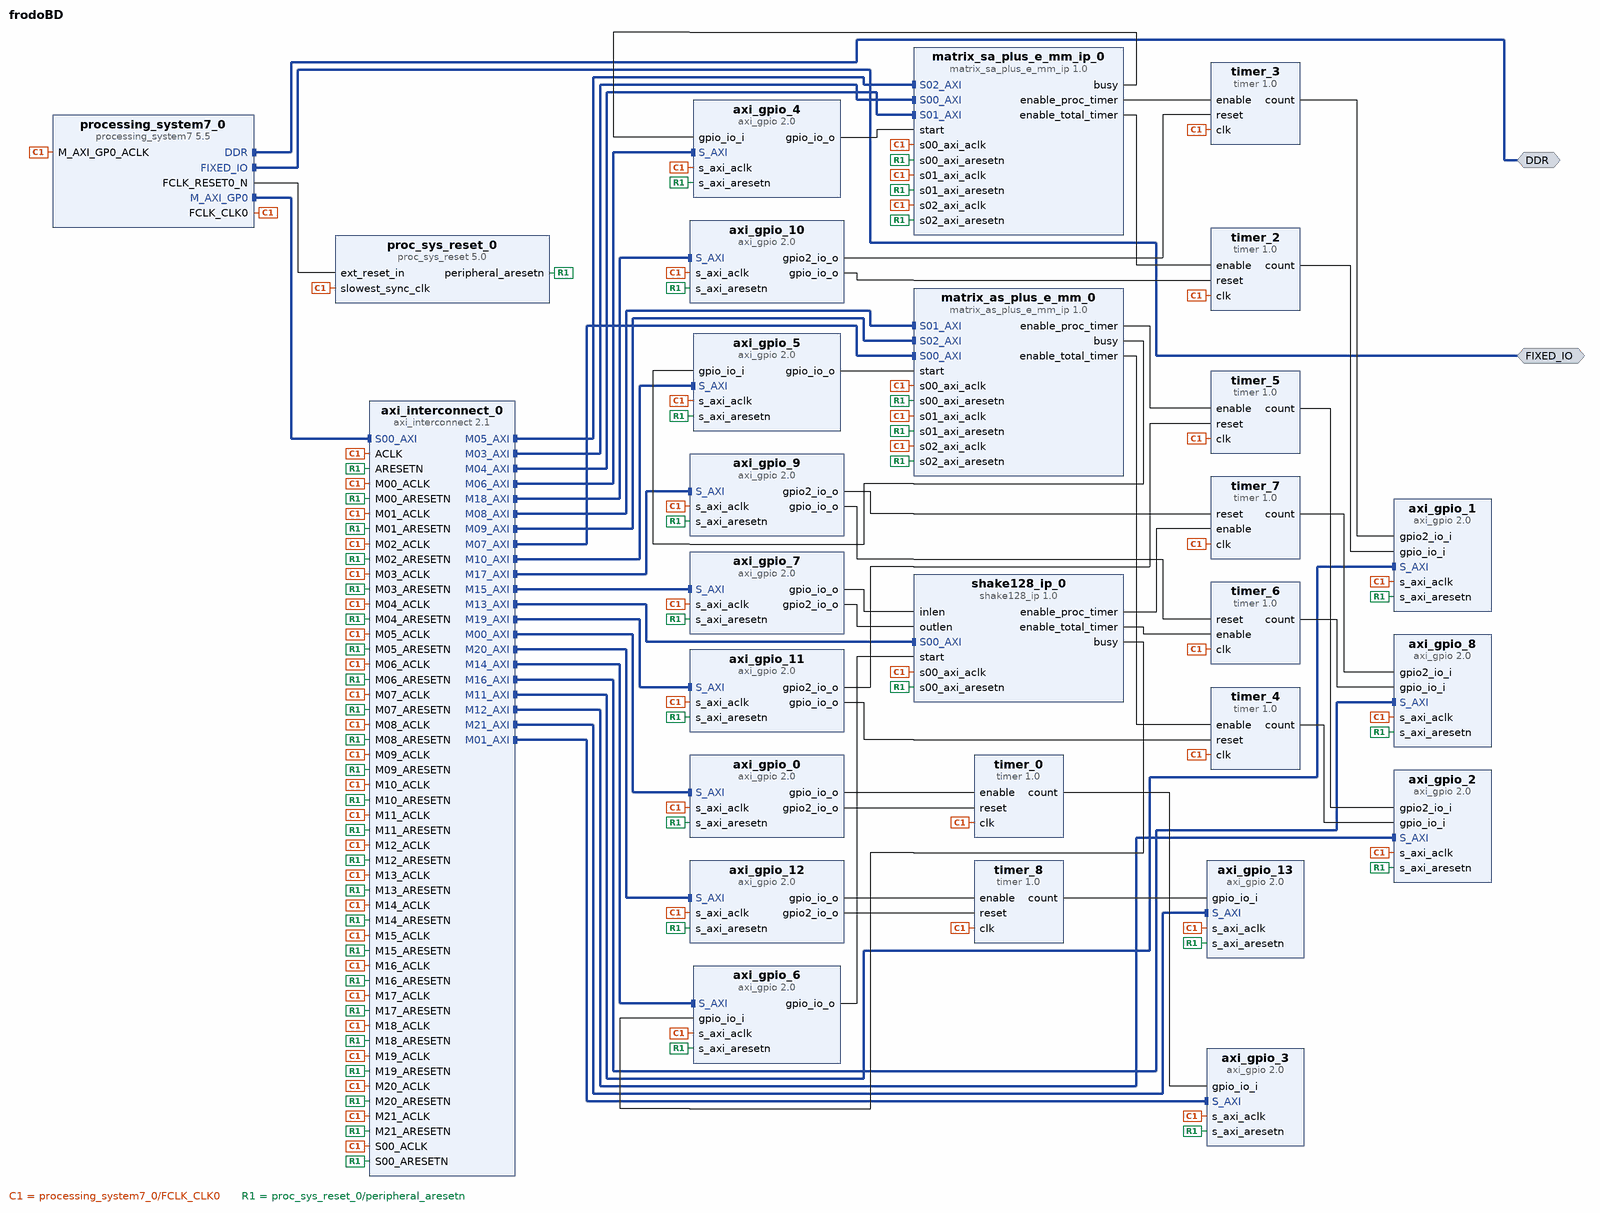
[diagram p0: block diagram of the top level]
# Vivado block design frodoBD, xc7z010clg400-1, Vivado 2019.1
create_bd_design frodoBD

create_bd_intf_port -mode Master -vlnv xilinx.com:interface:ddrx_rtl:1.0 DDR
create_bd_intf_port -mode Master -vlnv xilinx.com:display_processing_system7:fixedio_rtl:1.0 FIXED_IO

create_bd_cell -type ip -vlnv xilinx.com:ip:processing_system7:5.5 processing_system7_0
set_property -dict [list \
  CONFIG.PCW_APU_PERIPHERAL_FREQMHZ 667 \
  CONFIG.PCW_ENET0_ENET0_IO {MIO 16 .. 27} \
  CONFIG.PCW_ENET0_GRP_MDIO_ENABLE 1 \
  CONFIG.PCW_ENET0_GRP_MDIO_IO {MIO 52 .. 53} \
  CONFIG.PCW_ENET0_PERIPHERAL_ENABLE 1 \
  CONFIG.PCW_ENET0_RESET_ENABLE 0 \
  CONFIG.PCW_ENET_RESET_ENABLE 1 \
  CONFIG.PCW_ENET_RESET_SELECT {Share reset pin} \
  CONFIG.PCW_FPGA0_PERIPHERAL_FREQMHZ 100 \
  CONFIG.PCW_FPGA1_PERIPHERAL_FREQMHZ 100 \
  CONFIG.PCW_FPGA2_PERIPHERAL_FREQMHZ 33.333333 \
  CONFIG.PCW_GPIO_MIO_GPIO_ENABLE 1 \
  CONFIG.PCW_GPIO_MIO_GPIO_IO MIO \
  CONFIG.PCW_GPIO_PERIPHERAL_ENABLE 1 \
  CONFIG.PCW_I2C_RESET_ENABLE 0 \
  CONFIG.PCW_PRESET_BANK1_VOLTAGE {LVCMOS 1.8V} \
  CONFIG.PCW_QSPI_GRP_FBCLK_ENABLE 1 \
  CONFIG.PCW_QSPI_GRP_FBCLK_IO {MIO 8} \
  CONFIG.PCW_QSPI_GRP_SINGLE_SS_ENABLE 1 \
  CONFIG.PCW_QSPI_GRP_SINGLE_SS_IO {MIO 1 .. 6} \
  CONFIG.PCW_QSPI_PERIPHERAL_ENABLE 1 \
  CONFIG.PCW_QSPI_QSPI_IO {MIO 1 .. 6} \
  CONFIG.PCW_SD0_GRP_CD_ENABLE 1 \
  CONFIG.PCW_SD0_GRP_CD_IO {MIO 46} \
  CONFIG.PCW_SD0_GRP_WP_ENABLE 1 \
  CONFIG.PCW_SD0_GRP_WP_IO {MIO 50} \
  CONFIG.PCW_SD0_PERIPHERAL_ENABLE 1 \
  CONFIG.PCW_SD0_SD0_IO {MIO 40 .. 45} \
  CONFIG.PCW_SDIO_PERIPHERAL_FREQMHZ 25 \
  CONFIG.PCW_SINGLE_QSPI_DATA_MODE x4 \
  CONFIG.PCW_TTC0_PERIPHERAL_ENABLE 1 \
  CONFIG.PCW_TTC0_TTC0_IO EMIO \
  CONFIG.PCW_UART0_PERIPHERAL_ENABLE 1 \
  CONFIG.PCW_UART0_UART0_IO {MIO 14 .. 15} \
  CONFIG.PCW_UART1_PERIPHERAL_ENABLE 1 \
  CONFIG.PCW_UART1_UART1_IO {MIO 48 .. 49} \
  CONFIG.PCW_UART_PERIPHERAL_FREQMHZ 50 \
  CONFIG.PCW_UIPARAM_DDR_PARTNO {MT41K256M16 RE-125} \
  CONFIG.PCW_USB0_PERIPHERAL_ENABLE 1 \
  CONFIG.PCW_USB0_RESET_ENABLE 1 \
  CONFIG.PCW_USB0_RESET_IO {MIO 7} \
  CONFIG.PCW_USB0_USB0_IO {MIO 28 .. 39} \
  CONFIG.PCW_USB_RESET_ENABLE 1 \
  CONFIG.PCW_USB_RESET_SELECT {Share reset pin} \
] [get_bd_cells processing_system7_0]
# 278 more settings of processing_system7_0 are not shown: defaults, MIO pin electricals, DDR timing, and values the tool derives
create_bd_cell -type ip -vlnv xilinx.com:ip:proc_sys_reset:5.0 proc_sys_reset_0
create_bd_cell -type ip -vlnv xilinx.com:ip:axi_interconnect:2.1 axi_interconnect_0
set_property -dict {CONFIG.NUM_MI 22} [get_bd_cells axi_interconnect_0]
create_bd_cell -type ip -vlnv xilinx.com:ip:axi_gpio:2.0 axi_gpio_4
set_property -dict {CONFIG.C_GPIO_WIDTH 1} [get_bd_cells axi_gpio_4]
create_bd_cell -type ip -vlnv xilinx.com:ip:axi_gpio:2.0 axi_gpio_5
set_property -dict {CONFIG.C_GPIO_WIDTH 1} [get_bd_cells axi_gpio_5]
create_bd_cell -type ip -vlnv xilinx.com:user:timer:1.0 timer_2
create_bd_cell -type ip -vlnv xilinx.com:user:timer:1.0 timer_3
create_bd_cell -type ip -vlnv xilinx.com:ip:axi_gpio:2.0 axi_gpio_1
set_property -dict [list \
  CONFIG.C_ALL_INPUTS 1 \
  CONFIG.C_ALL_INPUTS_2 1 \
  CONFIG.C_GPIO_WIDTH 32 \
  CONFIG.C_IS_DUAL 1 \
] [get_bd_cells axi_gpio_1]
create_bd_cell -type ip -vlnv xilinx.com:ip:axi_gpio:2.0 axi_gpio_2
set_property -dict [list \
  CONFIG.C_ALL_INPUTS 1 \
  CONFIG.C_ALL_INPUTS_2 1 \
  CONFIG.C_GPIO_WIDTH 32 \
  CONFIG.C_IS_DUAL 1 \
] [get_bd_cells axi_gpio_2]
create_bd_cell -type ip -vlnv xilinx.com:user:timer:1.0 timer_4
create_bd_cell -type ip -vlnv xilinx.com:user:timer:1.0 timer_5
create_bd_cell -type ip -vlnv xilinx.com:ip:axi_gpio:2.0 axi_gpio_6
set_property -dict {CONFIG.C_GPIO_WIDTH 1} [get_bd_cells axi_gpio_6]
create_bd_cell -type ip -vlnv xilinx.com:ip:axi_gpio:2.0 axi_gpio_7
set_property -dict [list \
  CONFIG.C_ALL_INPUTS 0 \
  CONFIG.C_ALL_INPUTS_2 0 \
  CONFIG.C_ALL_OUTPUTS 1 \
  CONFIG.C_ALL_OUTPUTS_2 1 \
  CONFIG.C_GPIO2_WIDTH 15 \
  CONFIG.C_GPIO_WIDTH 15 \
  CONFIG.C_IS_DUAL 1 \
] [get_bd_cells axi_gpio_7]
create_bd_cell -type ip -vlnv xilinx.com:user:timer:1.0 timer_6
create_bd_cell -type ip -vlnv xilinx.com:user:timer:1.0 timer_7
create_bd_cell -type ip -vlnv xilinx.com:ip:axi_gpio:2.0 axi_gpio_8
set_property -dict {CONFIG.C_ALL_INPUTS 1 CONFIG.C_ALL_INPUTS_2 1 CONFIG.C_IS_DUAL 1} [get_bd_cells axi_gpio_8]
create_bd_cell -type ip -vlnv xilinx.com:user:shake128_ip:1.0 shake128_ip_0
create_bd_cell -type ip -vlnv xilinx.com:ip:axi_gpio:2.0 axi_gpio_9
set_property -dict [list \
  CONFIG.C_ALL_OUTPUTS 1 \
  CONFIG.C_ALL_OUTPUTS_2 1 \
  CONFIG.C_GPIO2_WIDTH 1 \
  CONFIG.C_GPIO_WIDTH 1 \
  CONFIG.C_IS_DUAL 1 \
] [get_bd_cells axi_gpio_9]
create_bd_cell -type ip -vlnv xilinx.com:ip:axi_gpio:2.0 axi_gpio_10
set_property -dict [list \
  CONFIG.C_ALL_INPUTS 0 \
  CONFIG.C_ALL_OUTPUTS 1 \
  CONFIG.C_ALL_OUTPUTS_2 1 \
  CONFIG.C_GPIO2_WIDTH 1 \
  CONFIG.C_GPIO_WIDTH 1 \
  CONFIG.C_IS_DUAL 1 \
] [get_bd_cells axi_gpio_10]
create_bd_cell -type ip -vlnv xilinx.com:ip:axi_gpio:2.0 axi_gpio_11
set_property -dict [list \
  CONFIG.C_ALL_OUTPUTS 1 \
  CONFIG.C_ALL_OUTPUTS_2 1 \
  CONFIG.C_GPIO2_WIDTH 1 \
  CONFIG.C_GPIO_WIDTH 1 \
  CONFIG.C_IS_DUAL 1 \
] [get_bd_cells axi_gpio_11]
create_bd_cell -type ip -vlnv xilinx.com:user:timer:1.0 timer_8
create_bd_cell -type ip -vlnv xilinx.com:ip:axi_gpio:2.0 axi_gpio_12
set_property -dict [list \
  CONFIG.C_ALL_OUTPUTS 1 \
  CONFIG.C_ALL_OUTPUTS_2 1 \
  CONFIG.C_GPIO2_WIDTH 1 \
  CONFIG.C_GPIO_WIDTH 1 \
  CONFIG.C_IS_DUAL 1 \
] [get_bd_cells axi_gpio_12]
create_bd_cell -type ip -vlnv xilinx.com:ip:axi_gpio:2.0 axi_gpio_13
set_property -dict {CONFIG.C_ALL_INPUTS 1} [get_bd_cells axi_gpio_13]
create_bd_cell -type ip -vlnv xilinx.com:user:matrix_as_plus_e_mm_ip:1.0 matrix_as_plus_e_mm_0
create_bd_cell -type ip -vlnv xilinx.com:user:matrix_sa_plus_e_mm_ip:1.0 matrix_sa_plus_e_mm_ip_0
create_bd_cell -type ip -vlnv xilinx.com:user:timer:1.0 timer_0
create_bd_cell -type ip -vlnv xilinx.com:ip:axi_gpio:2.0 axi_gpio_0
set_property -dict [list \
  CONFIG.C_ALL_OUTPUTS 1 \
  CONFIG.C_ALL_OUTPUTS_2 1 \
  CONFIG.C_GPIO2_WIDTH 1 \
  CONFIG.C_GPIO_WIDTH 1 \
  CONFIG.C_IS_DUAL 1 \
] [get_bd_cells axi_gpio_0]
create_bd_cell -type ip -vlnv xilinx.com:ip:axi_gpio:2.0 axi_gpio_3
set_property -dict {CONFIG.C_ALL_INPUTS 1} [get_bd_cells axi_gpio_3]

# ---- connections ----

connect_bd_intf_net [get_bd_intf_pins axi_interconnect_0/M05_AXI] [get_bd_intf_pins matrix_sa_plus_e_mm_ip_0/S02_AXI]
connect_bd_intf_net [get_bd_intf_ports DDR] [get_bd_intf_pins processing_system7_0/DDR]
connect_bd_intf_net [get_bd_intf_pins axi_interconnect_0/M15_AXI] [get_bd_intf_pins axi_gpio_7/S_AXI]
connect_bd_intf_net [get_bd_intf_pins axi_interconnect_0/M21_AXI] [get_bd_intf_pins axi_gpio_13/S_AXI]
connect_bd_intf_net [get_bd_intf_pins axi_interconnect_0/M13_AXI] [get_bd_intf_pins shake128_ip_0/S00_AXI]
connect_bd_intf_net [get_bd_intf_pins axi_interconnect_0/M08_AXI] [get_bd_intf_pins matrix_as_plus_e_mm_0/S01_AXI]
connect_bd_intf_net [get_bd_intf_pins axi_gpio_8/S_AXI] [get_bd_intf_pins axi_interconnect_0/M16_AXI]
connect_bd_intf_net [get_bd_intf_pins axi_interconnect_0/M03_AXI] [get_bd_intf_pins matrix_sa_plus_e_mm_ip_0/S00_AXI]
connect_bd_intf_net [get_bd_intf_pins axi_interconnect_0/M09_AXI] [get_bd_intf_pins matrix_as_plus_e_mm_0/S02_AXI]
connect_bd_intf_net [get_bd_intf_pins axi_gpio_6/S_AXI] [get_bd_intf_pins axi_interconnect_0/M14_AXI]
connect_bd_intf_net [get_bd_intf_pins axi_interconnect_0/S00_AXI] [get_bd_intf_pins processing_system7_0/M_AXI_GP0]
connect_bd_intf_net [get_bd_intf_pins axi_gpio_1/S_AXI] [get_bd_intf_pins axi_interconnect_0/M11_AXI]
connect_bd_intf_net [get_bd_intf_pins axi_interconnect_0/M17_AXI] [get_bd_intf_pins axi_gpio_9/S_AXI]
connect_bd_intf_net [get_bd_intf_ports FIXED_IO] [get_bd_intf_pins processing_system7_0/FIXED_IO]
connect_bd_intf_net [get_bd_intf_pins axi_gpio_11/S_AXI] [get_bd_intf_pins axi_interconnect_0/M19_AXI]
connect_bd_intf_net [get_bd_intf_pins axi_interconnect_0/M10_AXI] [get_bd_intf_pins axi_gpio_5/S_AXI]
connect_bd_intf_net [get_bd_intf_pins axi_interconnect_0/M04_AXI] [get_bd_intf_pins matrix_sa_plus_e_mm_ip_0/S01_AXI]
connect_bd_intf_net [get_bd_intf_pins axi_interconnect_0/M20_AXI] [get_bd_intf_pins axi_gpio_12/S_AXI]
connect_bd_intf_net [get_bd_intf_pins axi_gpio_0/S_AXI] [get_bd_intf_pins axi_interconnect_0/M00_AXI]
connect_bd_intf_net [get_bd_intf_pins axi_gpio_3/S_AXI] [get_bd_intf_pins axi_interconnect_0/M01_AXI]
connect_bd_intf_net [get_bd_intf_pins axi_gpio_10/S_AXI] [get_bd_intf_pins axi_interconnect_0/M18_AXI]
connect_bd_intf_net [get_bd_intf_pins axi_interconnect_0/M06_AXI] [get_bd_intf_pins axi_gpio_4/S_AXI]
connect_bd_intf_net [get_bd_intf_pins axi_interconnect_0/M07_AXI] [get_bd_intf_pins matrix_as_plus_e_mm_0/S00_AXI]
connect_bd_intf_net [get_bd_intf_pins axi_interconnect_0/M12_AXI] [get_bd_intf_pins axi_gpio_2/S_AXI]
connect_bd_net [get_bd_pins processing_system7_0/FCLK_CLK0] \
  [get_bd_pins proc_sys_reset_0/slowest_sync_clk] [get_bd_pins axi_interconnect_0/ACLK] \
  [get_bd_pins processing_system7_0/M_AXI_GP0_ACLK] [get_bd_pins axi_interconnect_0/S00_ACLK] \
  [get_bd_pins axi_interconnect_0/M00_ACLK] [get_bd_pins axi_interconnect_0/M01_ACLK] \
  [get_bd_pins axi_interconnect_0/M02_ACLK] [get_bd_pins axi_interconnect_0/M03_ACLK] \
  [get_bd_pins axi_interconnect_0/M04_ACLK] [get_bd_pins axi_interconnect_0/M05_ACLK] \
  [get_bd_pins axi_interconnect_0/M06_ACLK] [get_bd_pins axi_interconnect_0/M07_ACLK] \
  [get_bd_pins axi_interconnect_0/M08_ACLK] [get_bd_pins axi_interconnect_0/M09_ACLK] [get_bd_pins axi_gpio_4/s_axi_aclk] \
  [get_bd_pins axi_interconnect_0/M10_ACLK] [get_bd_pins axi_gpio_5/s_axi_aclk] [get_bd_pins axi_interconnect_0/M11_ACLK] \
  [get_bd_pins timer_2/clk] [get_bd_pins timer_3/clk] [get_bd_pins axi_gpio_1/s_axi_aclk] [get_bd_pins timer_4/clk] \
  [get_bd_pins timer_5/clk] [get_bd_pins axi_gpio_2/s_axi_aclk] [get_bd_pins axi_interconnect_0/M12_ACLK] \
  [get_bd_pins axi_gpio_7/s_axi_aclk] [get_bd_pins axi_gpio_6/s_axi_aclk] [get_bd_pins axi_interconnect_0/M13_ACLK] \
  [get_bd_pins axi_interconnect_0/M14_ACLK] [get_bd_pins axi_interconnect_0/M15_ACLK] [get_bd_pins timer_7/clk] \
  [get_bd_pins timer_6/clk] [get_bd_pins axi_gpio_8/s_axi_aclk] [get_bd_pins axi_interconnect_0/M16_ACLK] \
  [get_bd_pins shake128_ip_0/s00_axi_aclk] [get_bd_pins axi_gpio_9/s_axi_aclk] [get_bd_pins axi_interconnect_0/M17_ACLK] \
  [get_bd_pins axi_gpio_10/s_axi_aclk] [get_bd_pins axi_gpio_11/s_axi_aclk] [get_bd_pins axi_interconnect_0/M18_ACLK] \
  [get_bd_pins axi_interconnect_0/M19_ACLK] [get_bd_pins axi_gpio_12/s_axi_aclk] [get_bd_pins axi_gpio_13/s_axi_aclk] \
  [get_bd_pins timer_8/clk] [get_bd_pins axi_interconnect_0/M20_ACLK] [get_bd_pins axi_interconnect_0/M21_ACLK] \
  [get_bd_pins matrix_as_plus_e_mm_0/s00_axi_aclk] [get_bd_pins matrix_as_plus_e_mm_0/s02_axi_aclk] \
  [get_bd_pins matrix_as_plus_e_mm_0/s01_axi_aclk] [get_bd_pins matrix_sa_plus_e_mm_ip_0/s00_axi_aclk] \
  [get_bd_pins matrix_sa_plus_e_mm_ip_0/s01_axi_aclk] [get_bd_pins matrix_sa_plus_e_mm_ip_0/s02_axi_aclk] \
  [get_bd_pins axi_gpio_3/s_axi_aclk] [get_bd_pins axi_gpio_0/s_axi_aclk] [get_bd_pins timer_0/clk]
connect_bd_net [get_bd_pins proc_sys_reset_0/peripheral_aresetn] \
  [get_bd_pins axi_interconnect_0/ARESETN] [get_bd_pins axi_interconnect_0/S00_ARESETN] \
  [get_bd_pins axi_interconnect_0/M00_ARESETN] [get_bd_pins axi_interconnect_0/M01_ARESETN] \
  [get_bd_pins axi_interconnect_0/M02_ARESETN] [get_bd_pins axi_interconnect_0/M03_ARESETN] \
  [get_bd_pins axi_interconnect_0/M04_ARESETN] [get_bd_pins axi_interconnect_0/M05_ARESETN] \
  [get_bd_pins axi_interconnect_0/M06_ARESETN] [get_bd_pins axi_interconnect_0/M07_ARESETN] \
  [get_bd_pins axi_interconnect_0/M08_ARESETN] [get_bd_pins axi_interconnect_0/M09_ARESETN] \
  [get_bd_pins axi_gpio_4/s_axi_aresetn] [get_bd_pins axi_interconnect_0/M10_ARESETN] [get_bd_pins axi_gpio_5/s_axi_aresetn] \
  [get_bd_pins axi_interconnect_0/M11_ARESETN] [get_bd_pins axi_gpio_1/s_axi_aresetn] [get_bd_pins axi_gpio_2/s_axi_aresetn] \
  [get_bd_pins axi_interconnect_0/M12_ARESETN] [get_bd_pins axi_gpio_7/s_axi_aresetn] [get_bd_pins axi_gpio_6/s_axi_aresetn] \
  [get_bd_pins axi_interconnect_0/M13_ARESETN] [get_bd_pins axi_interconnect_0/M14_ARESETN] \
  [get_bd_pins axi_interconnect_0/M15_ARESETN] [get_bd_pins axi_gpio_8/s_axi_aresetn] \
  [get_bd_pins axi_interconnect_0/M16_ARESETN] [get_bd_pins shake128_ip_0/s00_axi_aresetn] \
  [get_bd_pins axi_gpio_9/s_axi_aresetn] [get_bd_pins axi_interconnect_0/M17_ARESETN] [get_bd_pins axi_gpio_10/s_axi_aresetn] \
  [get_bd_pins axi_gpio_11/s_axi_aresetn] [get_bd_pins axi_interconnect_0/M19_ARESETN] \
  [get_bd_pins axi_interconnect_0/M18_ARESETN] [get_bd_pins axi_gpio_12/s_axi_aresetn] \
  [get_bd_pins axi_gpio_13/s_axi_aresetn] [get_bd_pins axi_interconnect_0/M20_ARESETN] \
  [get_bd_pins axi_interconnect_0/M21_ARESETN] [get_bd_pins matrix_as_plus_e_mm_0/s00_axi_aresetn] \
  [get_bd_pins matrix_as_plus_e_mm_0/s02_axi_aresetn] [get_bd_pins matrix_as_plus_e_mm_0/s01_axi_aresetn] \
  [get_bd_pins matrix_sa_plus_e_mm_ip_0/s00_axi_aresetn] [get_bd_pins matrix_sa_plus_e_mm_ip_0/s01_axi_aresetn] \
  [get_bd_pins matrix_sa_plus_e_mm_ip_0/s02_axi_aresetn] [get_bd_pins axi_gpio_3/s_axi_aresetn] \
  [get_bd_pins axi_gpio_0/s_axi_aresetn]
connect_bd_net [get_bd_pins processing_system7_0/FCLK_RESET0_N] [get_bd_pins proc_sys_reset_0/ext_reset_in]
connect_bd_net [get_bd_pins axi_gpio_4/gpio_io_o] [get_bd_pins matrix_sa_plus_e_mm_ip_0/start]
connect_bd_net [get_bd_pins matrix_sa_plus_e_mm_ip_0/busy] [get_bd_pins axi_gpio_4/gpio_io_i]
connect_bd_net [get_bd_pins axi_gpio_5/gpio_io_o] [get_bd_pins matrix_as_plus_e_mm_0/start]
connect_bd_net [get_bd_pins matrix_as_plus_e_mm_0/busy] [get_bd_pins axi_gpio_5/gpio_io_i]
connect_bd_net [get_bd_pins matrix_sa_plus_e_mm_ip_0/enable_total_timer] [get_bd_pins timer_2/enable]
connect_bd_net [get_bd_pins matrix_sa_plus_e_mm_ip_0/enable_proc_timer] [get_bd_pins timer_3/enable]
connect_bd_net [get_bd_pins timer_2/count] [get_bd_pins axi_gpio_1/gpio_io_i]
connect_bd_net [get_bd_pins timer_3/count] [get_bd_pins axi_gpio_1/gpio2_io_i]
connect_bd_net [get_bd_pins timer_4/count] [get_bd_pins axi_gpio_2/gpio_io_i]
connect_bd_net [get_bd_pins timer_5/count] [get_bd_pins axi_gpio_2/gpio2_io_i]
connect_bd_net [get_bd_pins matrix_as_plus_e_mm_0/enable_total_timer] [get_bd_pins timer_4/enable]
connect_bd_net [get_bd_pins matrix_as_plus_e_mm_0/enable_proc_timer] [get_bd_pins timer_5/enable]
connect_bd_net [get_bd_pins axi_gpio_6/gpio_io_o] [get_bd_pins shake128_ip_0/start]
connect_bd_net [get_bd_pins shake128_ip_0/busy] [get_bd_pins axi_gpio_6/gpio_io_i]
connect_bd_net [get_bd_pins axi_gpio_7/gpio_io_o] [get_bd_pins shake128_ip_0/inlen]
connect_bd_net [get_bd_pins axi_gpio_7/gpio2_io_o] [get_bd_pins shake128_ip_0/outlen]
connect_bd_net [get_bd_pins shake128_ip_0/enable_total_timer] [get_bd_pins timer_6/enable]
connect_bd_net [get_bd_pins shake128_ip_0/enable_proc_timer] [get_bd_pins timer_7/enable]
connect_bd_net [get_bd_pins timer_6/count] [get_bd_pins axi_gpio_8/gpio_io_i]
connect_bd_net [get_bd_pins timer_7/count] [get_bd_pins axi_gpio_8/gpio2_io_i]
connect_bd_net [get_bd_pins axi_gpio_9/gpio_io_o] [get_bd_pins timer_6/reset]
connect_bd_net [get_bd_pins axi_gpio_9/gpio2_io_o] [get_bd_pins timer_7/reset]
connect_bd_net [get_bd_pins axi_gpio_10/gpio_io_o] [get_bd_pins timer_2/reset]
connect_bd_net [get_bd_pins axi_gpio_10/gpio2_io_o] [get_bd_pins timer_3/reset]
connect_bd_net [get_bd_pins axi_gpio_11/gpio_io_o] [get_bd_pins timer_4/reset]
connect_bd_net [get_bd_pins axi_gpio_11/gpio2_io_o] [get_bd_pins timer_5/reset]
connect_bd_net [get_bd_pins axi_gpio_12/gpio_io_o] [get_bd_pins timer_8/enable]
connect_bd_net [get_bd_pins axi_gpio_12/gpio2_io_o] [get_bd_pins timer_8/reset]
connect_bd_net [get_bd_pins timer_8/count] [get_bd_pins axi_gpio_13/gpio_io_i]
connect_bd_net [get_bd_pins axi_gpio_0/gpio_io_o] [get_bd_pins timer_0/enable]
connect_bd_net [get_bd_pins axi_gpio_0/gpio2_io_o] [get_bd_pins timer_0/reset]
connect_bd_net [get_bd_pins timer_0/count] [get_bd_pins axi_gpio_3/gpio_io_i]

# ---- address map ----
assign_bd_address -offset 0x41200000 -range 64K -target_address_space [get_bd_addr_spaces processing_system7_0/Data] [get_bd_addr_segs axi_gpio_5/S_AXI/Reg]
assign_bd_address -offset 0x41210000 -range 64K -target_address_space [get_bd_addr_spaces processing_system7_0/Data] [get_bd_addr_segs axi_gpio_1/S_AXI/Reg]
assign_bd_address -offset 0x41220000 -range 64K -target_address_space [get_bd_addr_spaces processing_system7_0/Data] [get_bd_addr_segs axi_gpio_0/S_AXI/Reg]
assign_bd_address -offset 0x41230000 -range 64K -target_address_space [get_bd_addr_spaces processing_system7_0/Data] [get_bd_addr_segs axi_gpio_3/S_AXI/Reg]
assign_bd_address -offset 0x41240000 -range 64K -target_address_space [get_bd_addr_spaces processing_system7_0/Data] [get_bd_addr_segs axi_gpio_4/S_AXI/Reg]
assign_bd_address -offset 0x41250000 -range 64K -target_address_space [get_bd_addr_spaces processing_system7_0/Data] [get_bd_addr_segs axi_gpio_2/S_AXI/Reg]
assign_bd_address -offset 0x41260000 -range 64K -target_address_space [get_bd_addr_spaces processing_system7_0/Data] [get_bd_addr_segs axi_gpio_6/S_AXI/Reg]
assign_bd_address -offset 0x41270000 -range 64K -target_address_space [get_bd_addr_spaces processing_system7_0/Data] [get_bd_addr_segs axi_gpio_7/S_AXI/Reg]
assign_bd_address -offset 0x41280000 -range 64K -target_address_space [get_bd_addr_spaces processing_system7_0/Data] [get_bd_addr_segs axi_gpio_8/S_AXI/Reg]
assign_bd_address -offset 0x41290000 -range 64K -target_address_space [get_bd_addr_spaces processing_system7_0/Data] [get_bd_addr_segs axi_gpio_9/S_AXI/Reg]
assign_bd_address -offset 0x412A0000 -range 64K -target_address_space [get_bd_addr_spaces processing_system7_0/Data] [get_bd_addr_segs axi_gpio_11/S_AXI/Reg]
assign_bd_address -offset 0x412B0000 -range 64K -target_address_space [get_bd_addr_spaces processing_system7_0/Data] [get_bd_addr_segs axi_gpio_10/S_AXI/Reg]
assign_bd_address -offset 0x412C0000 -range 64K -target_address_space [get_bd_addr_spaces processing_system7_0/Data] [get_bd_addr_segs axi_gpio_13/S_AXI/Reg]
assign_bd_address -offset 0x412D0000 -range 64K -target_address_space [get_bd_addr_spaces processing_system7_0/Data] [get_bd_addr_segs axi_gpio_12/S_AXI/Reg]
assign_bd_address -offset 0x43C00000 -range 64K -target_address_space [get_bd_addr_spaces processing_system7_0/Data] [get_bd_addr_segs matrix_as_plus_e_mm_0/S02_AXI/S02_AXI_reg]
assign_bd_address -offset 0x43C20000 -range 64K -target_address_space [get_bd_addr_spaces processing_system7_0/Data] [get_bd_addr_segs matrix_sa_plus_e_mm_ip_0/S00_AXI/S00_AXI_reg]
assign_bd_address -offset 0x43C30000 -range 64K -target_address_space [get_bd_addr_spaces processing_system7_0/Data] [get_bd_addr_segs matrix_sa_plus_e_mm_ip_0/S01_AXI/S01_AXI_reg]
assign_bd_address -offset 0x43C40000 -range 64K -target_address_space [get_bd_addr_spaces processing_system7_0/Data] [get_bd_addr_segs matrix_sa_plus_e_mm_ip_0/S02_AXI/S02_AXI_reg]
assign_bd_address -offset 0x43C50000 -range 64K -target_address_space [get_bd_addr_spaces processing_system7_0/Data] [get_bd_addr_segs matrix_as_plus_e_mm_0/S01_AXI/S01_AXI_reg]
assign_bd_address -offset 0x43C60000 -range 64K -target_address_space [get_bd_addr_spaces processing_system7_0/Data] [get_bd_addr_segs shake128_ip_0/S00_AXI/S00_AXI_reg]
assign_bd_address -offset 0x43C80000 -range 64K -target_address_space [get_bd_addr_spaces processing_system7_0/Data] [get_bd_addr_segs matrix_as_plus_e_mm_0/S00_AXI/S00_AXI_reg]

validate_bd_design
save_bd_design
